# EAGLE design botmagneto (EAGLE 5.11)
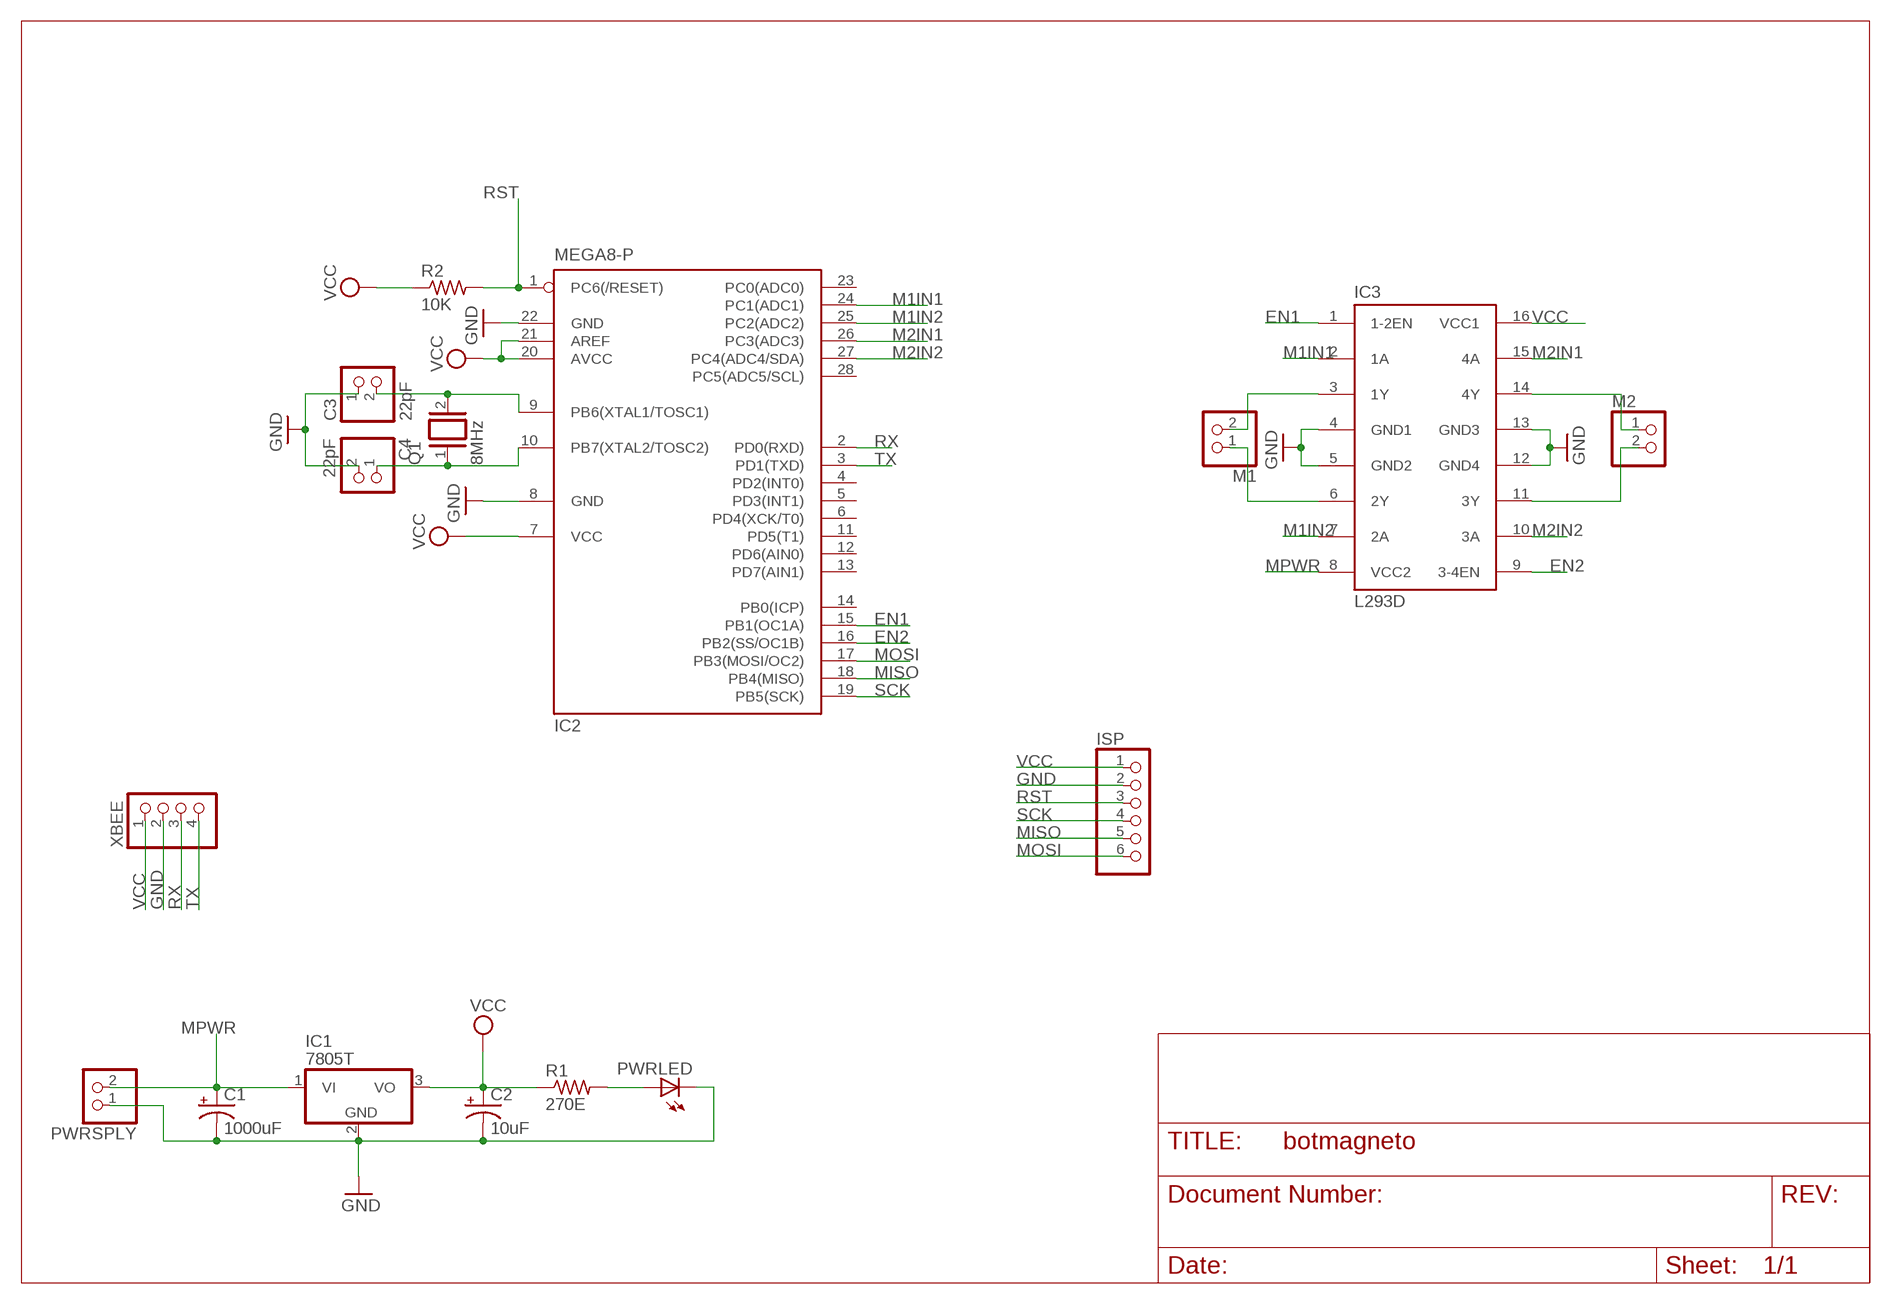
[diagram p0: schematic, sheet 1]

## Parts
C1  1000uF  CPOL-USE3.5-8  [E3,5-8]
C2  10uF  CPOL-USE2-5  [E2-5]
C3  22pF  PINHD-1X2  [1X02]
C4  22pF  PINHD-1X2  [1X02]
IC1  7805T  [TO220H]
IC2  MEGA8-P  [DIL28-3]
IC3  L293D  [DIL16]
ISP  PINHD-1X6  [1X06]
M1  PINHD-1X2  [1X02]
M2  PINHD-1X2  [1X02]
PWRLED  LED5MM  [LED5MM]
PWRSPLY  PINHD-1X2  [1X02]
Q1  8MHz  XTAL/S  [QS]
R1  270E  R-US_0207/7  [0207/7]
R2  10K  R-US_0207/7  [0207/7]
XBEE  PINHD-1X4  [1X04]

## Nets
EN1: IC2.15(PB1(OC1A)) IC3.1(1-2EN)
EN2: IC2.16(PB2(SS/OC1B)) IC3.9(3-4EN)
GND: C1.- C2.- C3.1 C4.2 IC1.2(GND) IC2.8(GND) IC2.22(GND) IC3.4(GND1) IC3.5(GND2) IC3.12(GND4) IC3.13(GND3) ISP.2 PWRLED.K(C) PWRSPLY.1 XBEE.2
M1IN1: IC2.24(PC1(ADC1)) IC3.2(1A)
M1IN2: IC2.25(PC2(ADC2)) IC3.7(2A)
M2IN1: IC2.26(PC3(ADC3)) IC3.15(4A)
M2IN2: IC2.27(PC4(ADC4/SDA)) IC3.10(3A)
MISO: IC2.18(PB4(MISO)) ISP.5
MOSI: IC2.17(PB3(MOSI/OC2)) ISP.6
MPWR: C1.+ IC1.1(VI) IC3.8(VCC2) PWRSPLY.2
N$2: C3.2 IC2.9(PB6(XTAL1/TOSC1)) Q1.2
N$3: PWRLED.A R1.2
N$4: C4.1 IC2.10(PB7(XTAL2/TOSC2)) Q1.1
N$9: IC3.3(1Y) M1.2
N$10: IC3.6(2Y) M1.1
N$11: IC3.14(4Y) M2.1
N$12: IC3.11(3Y) M2.2
RST: IC2.1(PC6(/RESET)) ISP.3 R2.2
RX: IC2.2(PD0(RXD)) XBEE.3
SCK: IC2.19(PB5(SCK)) ISP.4
TX: IC2.3(PD1(TXD)) XBEE.4
VCC: C2.+ IC1.3(VO) IC2.7(VCC) IC2.20(AVCC) IC2.21(AREF) IC3.16(VCC1) ISP.1 R1.1 R2.1 XBEE.1
Unconnected: IC2.4(PD2(INT0)) IC2.5(PD3(INT1)) IC2.6(PD4(XCK/T0)) IC2.11(PD5(T1)) IC2.12(PD6(AIN0)) IC2.13(PD7(AIN1)) IC2.14(PB0(ICP)) IC2.23(PC0(ADC0)) IC2.28(PC5(ADC5/SCL))

## Library data of the parts
C1 C2 = resistor:CPOL-US: POLARIZED CAPACITOR, American symbol
C3 C4 M1 M2 PWRSPLY = pinhead:PINHD-1X2: PIN HEADER
IC1 = linear:78*: Positive VOLTAGE REGULATOR Source: http://cache.national.com/ds/LM/LM78L05.pdf http://www.fairchildsemi.com/ds/LM/LM7805.pdf
IC2 = atmel:MEGA8-P: MICROCONTROLLER 8 Kbytes FLASH, 1 kbytes SRAM, 512 bytes EEPROM, USART, 4-channel 10 bit ADC, 2-channel 8 bit ADC Pin compatible with Atmega48, ATMega88, ATMega168 Source: avr.lbr; OC_FARNELL: unknown; OC_NEWARK: unknown
IC3 = st-microelectronics:L293D: PUSH-PULL 4 CHANNEL DRIVER; MPN: L293D; OC_FARNELL: 9589619; OC_NEWARK: 56P8249
ISP = pinhead:PINHD-1X6: PIN HEADER
PWRLED = led:LED: LED OSRAM: - CHIPLED LG R971, LG N971, LY N971, LG Q971, LY Q971, LO R971, LY R971 LH N974, LH R974 LS Q976, LO Q976, LY Q976 LO Q996 - Hyper CHIPLED LW Q18S LB Q993, LB Q99A, LB R99A - SideLED LS A670, LO A670, LY A670, LG A670, LP A670 LB A673, LV A673, LT A673, LW A673 LH A674 LY A675 LS A676, LA A676, LO A676, LY A676, LW A676 LS A679, LY A679, LG A679 - Hyper Micro SIDELED® LS Y876, LA Y876, LO Y876, LY Y876 LT Y87S - SmartLED LW L88C, LW L88S LB L89C, LB L89S, LG L890 LS L89K, LO L89K, LY L89K LS L896, LA L896, LO L896, LY L896 - TOPLED LS T670, LO T670, LY T670, LG T670, LP T670 LSG T670, LSP T670, LSY T670, LOP T670, LYG T670 LG T671, LOG T671, LSG T671 LB T673, LV T673, LT T673, LW T673 LH T674 LS T676, LA T676, LO T676, LY T676, LB T676, LH T676, LSB T676, LW T676 LB T67C, LV T67C, LT T67C, LS T67K, LO T67K, LY T67K, LW E67C LS E67B, LA E67B, LO E67B, LY E67B, LB E67C, LV E67C, LT E67C LW T67C LS T679, LY T679, LG T679 LS T770, LO T770, LY T770, LG T770, LP T770 LB T773, LV T773, LT T773, LW T773 LH T774 LS E675, LA E675, LY E675, LS T675 LS T776, LA T776, LO T776, LY T776, LB T776 LHGB T686 LT T68C, LB T68C - Hyper Mini TOPLED® LB M676 - Mini TOPLED Santana® LG M470 LS M47K, LO M47K, LY M47K Source: http://www.osram.convergy.de LUXEON: - LUMILED® LXK2-PW12-R00, LXK2-PW12-S00, LXK2-PW14-U00, LXK2-PW14-V00 LXK2-PM12-R00, LXK2-PM12-S00, LXK2-PM14-U00 LXK2-PE12-Q00, LXK2-PE12-R00, LXK2-PE12-S00, LXK2-PE14-T00, LXK2-PE14-U00 LXK2-PB12-K00, LXK2-PB12-L00, LXK2-PB12-M00, LXK2-PB14-N00, LXK2-PB14-P00, LXK2-PB14-Q00 LXK2-PR12-L00, LXK2-PR12-M00, LXK2-PR14-Q00, LXK2-PR14-R00 LXK2-PD12-Q00, LXK2-PD12-R00, LXK2-PD12-S00 LXK2-PH12-R00, LXK2-PH12-S00 LXK2-PL12-P00, LXK2-PL12-Q00, LXK2-PL12-R00 Source: www.luxeon.com KINGBRIGHT: KA-3528ASYC Source: www.kingbright.com
Q1 = special:XTAL/S: CRYSTAL
R1 R2 = resistor:R-US_: RESISTOR, American symbol
XBEE = pinhead:PINHD-1X4: PIN HEADER

## Board
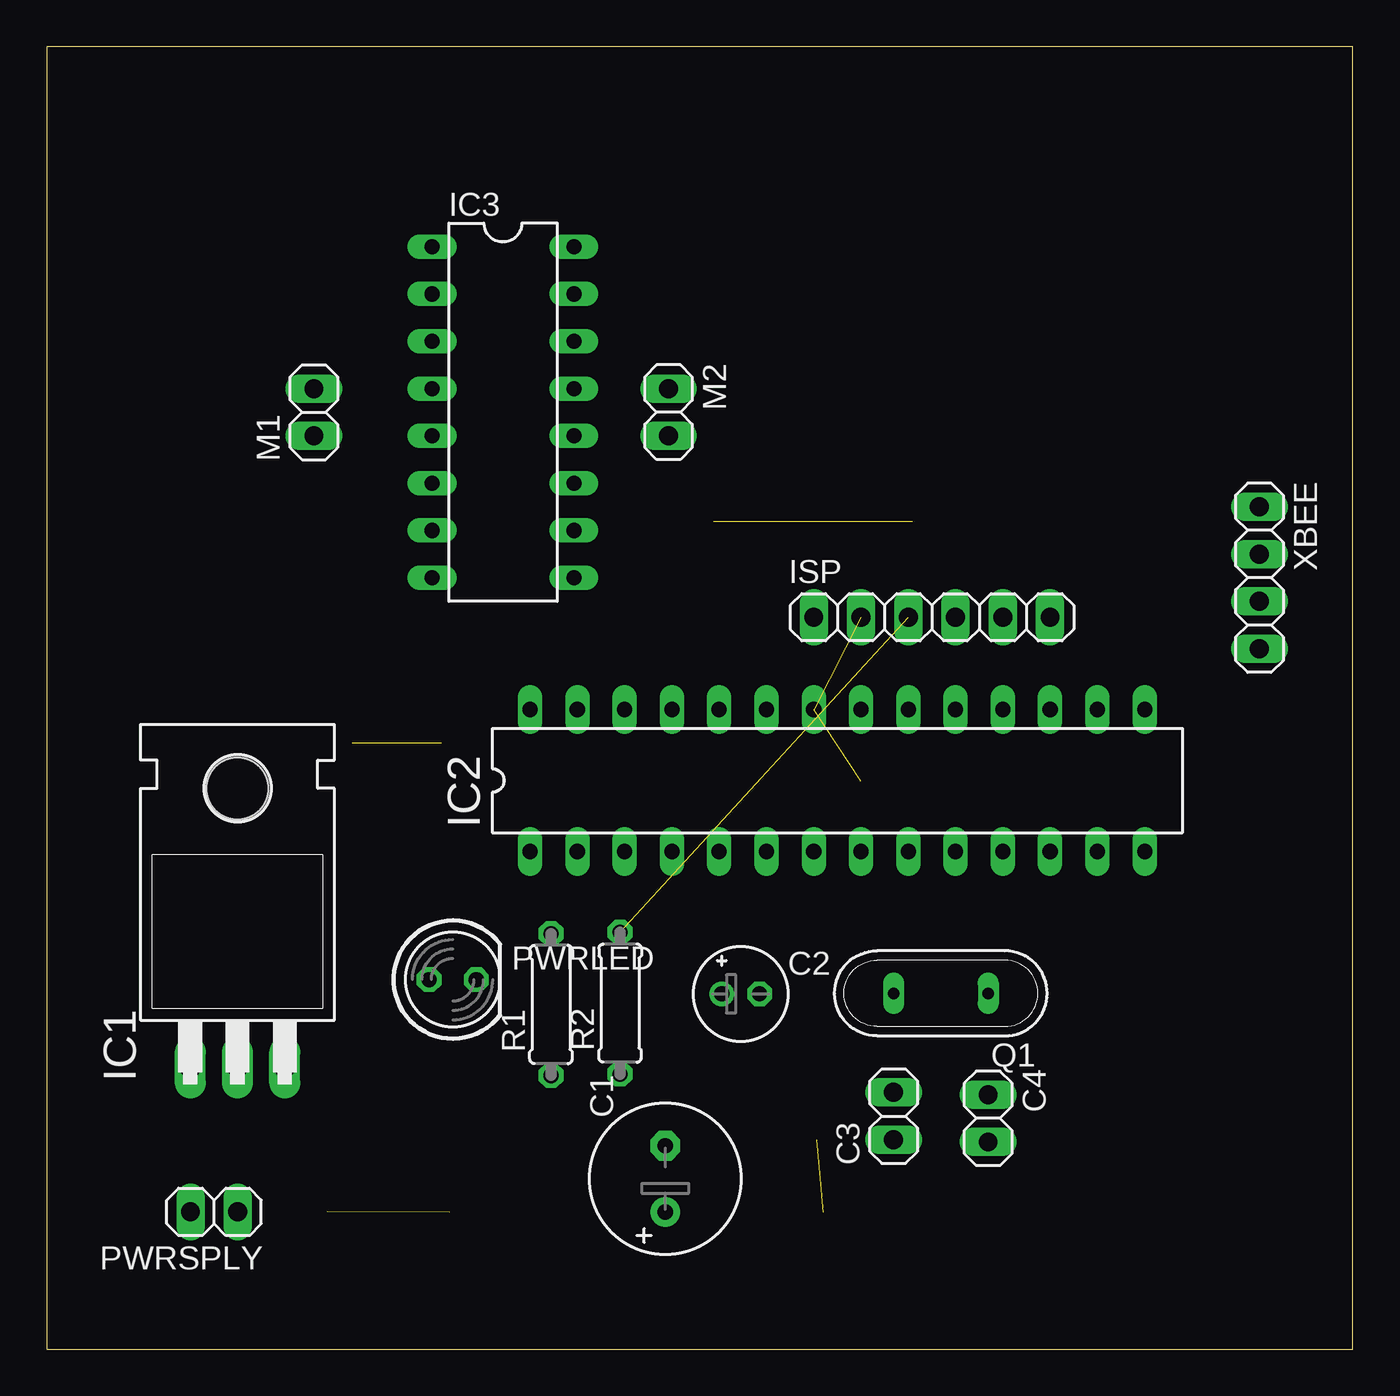
[diagram p1: board, top side]
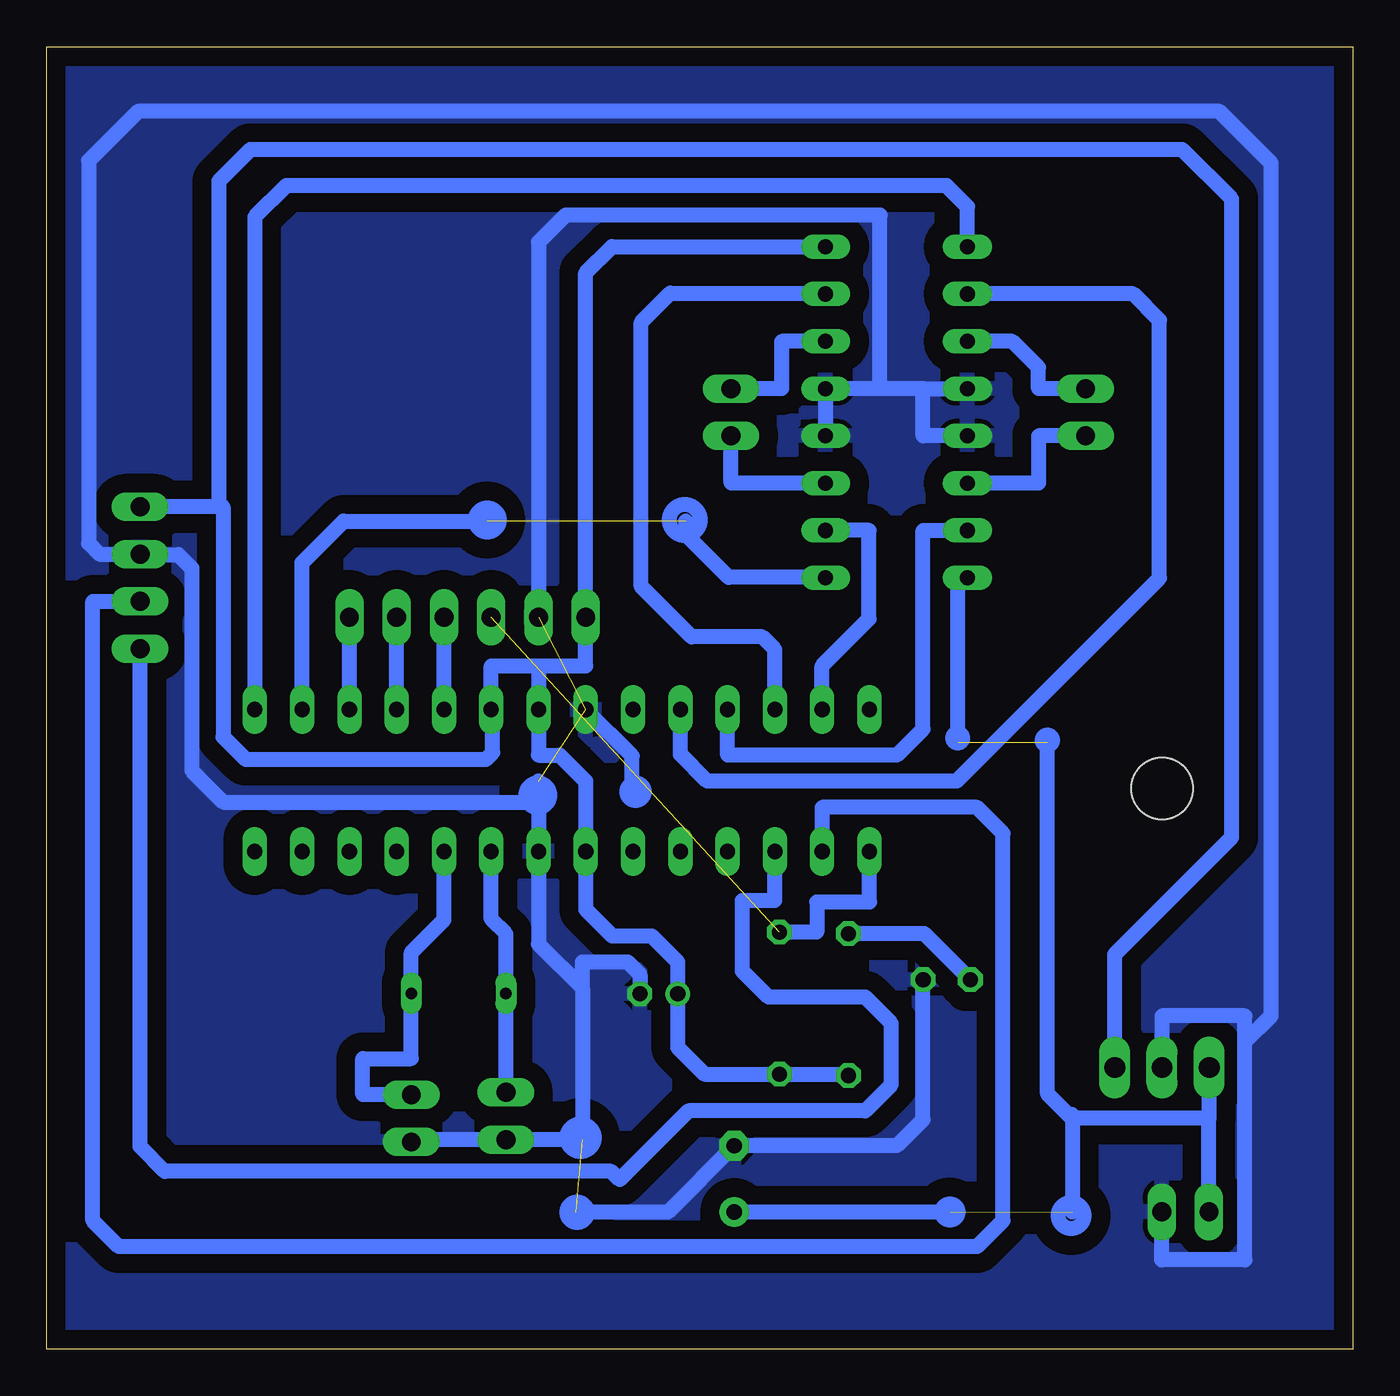
[diagram p2: board, bottom side, seen from below]

Size 70.19 x 69.95 mm. Coordinates in mm from the lower left corner, seen from the top.
Outline: 0,0 70.19,0 70.19,69.95 0,69.95 0,0
Copper layers (1*16): Top 0.035mm / dielectric 1.5mm / Bottom 0.035mm
Design rules "default *": minimum track width 0.8mm, minimum drill 24mil, track to track 0.6mm, track to pad 8mil, pad to pad 8mil, via to via 8mil, smd to smd 8mil, copper to edge 40mil, drill to drill 8mil, minimum pad ring 10mil, minimum via ring 8mil, stop-mask expansion 4mil, vias tented up to drill 0mil, thermal gap 10mil

### Footprints (pad centres in the part's own frame; a part is rotated, then mirrored left to right if it is on the bottom)
E3,5-8 = drill 0.813 pad 1.6 round: + -1.778,0 | drill 0.813 pad 1.6 octagon: - 1.778,0
E2-5 = drill 0.813 pad 1.27 round: + -1.016,0 | drill 0.813 pad 1.27 octagon: - 1.016,0
1X02 = drill 1.016 long: 1 -1.27,0; 2 1.27,0
TO220H = drill 1.118 long: 1 -2.54,-10.16; 2 0,-10.16; 3 2.54,-10.16 | hole 3.302: 0,4.826
DIL28-3 = drill 0.813 long: 1 -16.51,-3.81; 2 -13.97,-3.81; 3 -11.43,-3.81; 4 -8.89,-3.81; 5 -6.35,-3.81; 6 -3.81,-3.81; 7 -1.27,-3.81; 8 1.27,-3.81; 9 3.81,-3.81; 10 6.35,-3.81; 11 8.89,-3.81; 12 11.43,-3.81; 13 13.97,-3.81; 14 16.51,-3.81; 15 16.51,3.81; 16 13.97,3.81; 17 11.43,3.81; 18 8.89,3.81; 19 6.35,3.81; 20 3.81,3.81; 21 1.27,3.81; 22 -1.27,3.81; 23 -3.81,3.81; 24 -6.35,3.81; 25 -8.89,3.81; 26 -11.43,3.81; 27 -13.97,3.81; 28 -16.51,3.81
DIL16 = drill 0.813 long: 1 -8.89,-3.81; 2 -6.35,-3.81; 3 -3.81,-3.81; 4 -1.27,-3.81; 5 1.27,-3.81; 6 3.81,-3.81; 7 6.35,-3.81; 8 8.89,-3.81; 9 8.89,3.81; 10 6.35,3.81; 11 3.81,3.81; 12 1.27,3.81; 13 -1.27,3.81; 14 -3.81,3.81; 15 -6.35,3.81; 16 -8.89,3.81
1X06 = drill 1.016 long: 1 -6.35,0; 2 -3.81,0; 3 -1.27,0; 4 1.27,0; 5 3.81,0; 6 6.35,0
LED5MM = drill 0.813 octagon: A -1.27,0; K 1.27,0
QS = drill 0.61 long: 1 -2.54,0; 2 2.54,0
0207/7 = drill 0.813 octagon: 1 -3.81,0; 2 3.81,0
1X04 = drill 1.016 long: 1 -3.81,0; 2 -1.27,0; 3 1.27,0; 4 3.81,0

### Placement (x,y rotation side)
C1  33.24,9.14 90 top
C2  37.29,19.08 0 top
C3  45.51,12.52 90 top
C4  50.59,12.4 270 top
IC1  10.26,25.29 0 top
IC2  42.49,30.54 0 top
IC3  24.52,50.31 270 top
ISP  47.57,39.31 0 top
M1  14.36,50.31 90 top
M2  33.41,50.31 270 top
PWRLED  21.82,19.85 0 top
PWRSPLY  9,7.37 180 top
Q1  48.05,19.11 180 top
R1  27.11,18.51 90 top
R2  30.81,18.58 90 top
XBEE  65.16,41.42 270 top

### Tracks (layer width: path | path; a pad name or v marks a point on that pad's centre or on a via)
EN1
  Bottom 0.8: IC2.15 59,60.8 57.31,62.49 21.84,62.49 20.71,61.36 IC3.1
EN2  (1 unrouted)
  Bottom 0.8: IC2.16 56.47,42.23 54.23,44.47 46.51,44.47 | IC3.9 28.36,41.45 33.54,41.45 35.84,43.74 35.84,44.47
GND  (3 unrouted)
  Bottom 0.8: 25.4,51.59 IC3.13 IC3.12 | 23.1,51.59 25.4,51.59 | 5.8,16.5 4.4,17.9 4.4,63.7 7.18,66.48 65.27,66.48 67.93,63.82 67.93,43.27 67.35,42.7 XBEE.2 65.13,42.67 63.1,42.67 62.38,41.94 62.38,31.06 60.69,29.37 43.76,29.37 | ISP.2 43.76,59.44 42.3,60.9 25.4,60.9 25.4,51.59 | 41.4,19.4 41.4,11.25 C3.1 50.59,11.25 C4.2 | 43.76,29.37 IC2.8 43.76,21.76 41.4,19.4 | 43.76,29.37 43.76,30.5 | PWRLED.K 23.09,12.33 24.5,10.92 C1.- 36.8,7.36 41.75,7.36 | 5.8,16.5 5.8,4.8 10.27,4.8 PWRSPLY.1 | 5.8,16.5 5.8,17.9 10.26,17.9 IC1.2 | 23.1,51.59 IC3.4 | 23.1,51.59 23.1,49.05 IC3.5 | 41.4,19.4 41.4,20.8 38.97,20.8 38.31,20.14 C2.- | IC2.22 38.73,31.86 38.73,29.93
  pour Bottom (isolate 1.016): 69.38,68.41 69.38,1.69 68.77,1.09 1.21,1.09 0.84,1.45 0.84,69.02 1.09,69.26 69.26,69.26
M1IN1
  Bottom 0.8: IC3.2 11.8,56.66 10.4,55.27 10.4,41.4 21.3,30.5 34.7,30.5 36.14,31.94 IC2.24
M1IN2
  Bottom 0.8: IC2.25 33.6,31.9 24.5,31.9 23.1,33.3 23.1,43.97 IC3.7
M2IN1
  Bottom 0.8: IC3.15 28.38,56.71 36.68,56.71 38.25,55.15 38.25,40.97 35.53,38.25 31.73,38.25 31.06,37.58 IC2.26
M2IN2
  Bottom 0.8: IC3.10 26,43.97 26,39.22 28.52,36.7 IC2.27
MISO
  Bottom 0.8: IC2.18 ISP.5
MOSI
  Bottom 0.8: IC2.17 ISP.6
MPWR  (2 unrouted)
  Bottom 0.8: 7.73,12.39 7.74,12.4 15.1,12.4 15.17,12.47 | 7.73,12.39 7.72,12.4 IC1.1 | PWRSPLY.2 7.73,12.39 | C1.+ 21.66,7.36 | 15.17,12.47 16.41,13.71 16.41,32.56 | 15.1,7.37 15.08,7.38 15.08,12.59 | 15.08,12.59 15.32,12.59 | IC3.8 21.23,40.9 21.23,32.56 | 15.08,12.59 15.17,12.5 15.17,12.47
N$2
  Bottom 0.8: Q1.2 45.51,22.3 46.3,23.09 IC2.9 | Q1.2 | C3.2 Q1.2
N$3
  Bottom 0.8: R1.2 23.02,22.32 PWRLED.A
N$4
  Bottom 0.8: IC2.10 48.84,23.05 50.59,21.3 Q1.1 50.59,15.6 53.2,15.6 53.2,13.66 C4.1
N$9
  Bottom 0.8: IC3.3 18.3,54.12 16.9,52.73 16.9,51.59 M1.2
N$10
  Bottom 0.8: M1.1 16.9,49.05 16.9,46.51 IC3.6
N$11
  Bottom 0.8: IC3.14 30.7,54.12 30.7,51.59 M2.1
N$12
  Bottom 0.8: M2.2 33.41,46.51 IC3.11
RST  (1 unrouted)
  Bottom 0.8: R2.2 28.8,22.39 28.8,24 25.98,24 IC2.1
RX
  Bottom 0.8: XBEE.3 67.7,40.16 67.7,6.9 66.3,5.5 20.2,5.5 18.8,6.9 18.8,27.7 20.2,29.1 28.52,29.1 IC2.2
SCK
  Bottom 0.8: IC2.19 ISP.4
TX
  Bottom 0.8: IC2.3 31.06,24.1 32.8,24.1 32.8,20.3 31.4,18.9 26.2,18.9 24.8,17.5 24.8,14.2 26.2,12.8 35.7,12.8 39.4,9.1 39.85,9.55 63.83,9.55 65.16,10.88 XBEE.4
VCC
  Bottom 0.8: 43.76,36.7 46.3,36.7 IC2.20 46.21,34.26 46.21,32.03 46.57,31.67 59.48,31.67 60.7,32.88 60.7,45.23 | 43.76,36.7 41.22,36.7 ISP.1 41.22,57.8 39.81,59.2 IC3.16 | IC1.3 12.8,21.2 6.51,27.48 6.51,61.77 9.17,64.42 59.24,64.42 60.93,62.73 60.93,45.47 60.7,45.23 | 60.7,45.23 XBEE.1 | 43.76,36.7 IC2.21 43.76,31.9 42.62,31.9 41.22,30.5 IC2.7 41.22,23.62 39.8,22.2 37.67,22.2 36.27,20.8 C2.+ 36.27,16.2 34.85,14.77 R2.1 27.18,14.77 R1.1
(copper drawn outside any net)
  shapes: Bottom circle x10